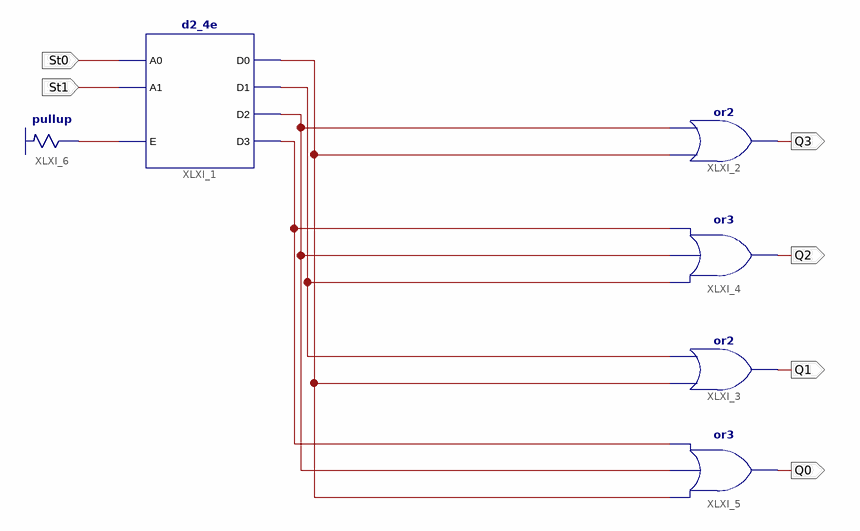
[diagram p0: schematic sheet 1]
// Xilinx ISE schematic FSM_state.sch (spartan3e) as structural Verilog: 6 symbols, 6 ports
module FSM_state (
  input  St0,
  input  St1,
  output Q0,
  output Q1,
  output Q2,
  output Q3
);

  wire XLXN_8, XLXN_9, XLXN_10, XLXN_12, XLXN_17;

  d2_4e XLXI_1 (.A0(St0), .A1(St1), .E(XLXN_8), .D0(XLXN_9), .D1(XLXN_10), .D2(XLXN_12), .D3(XLXN_17));
  or XLXI_2 (Q3, XLXN_9, XLXN_12);
  or XLXI_5 (Q0, XLXN_9, XLXN_12, XLXN_17);
  or XLXI_3 (Q1, XLXN_9, XLXN_10);
  or XLXI_4 (Q2, XLXN_10, XLXN_12, XLXN_17);
  \pullup  XLXI_6 (.O(XLXN_8));
endmodule
